# Altium schematic sheet HV_PSU.SchDoc
size A4; SheetNumber: 7; SheetTotal: 7
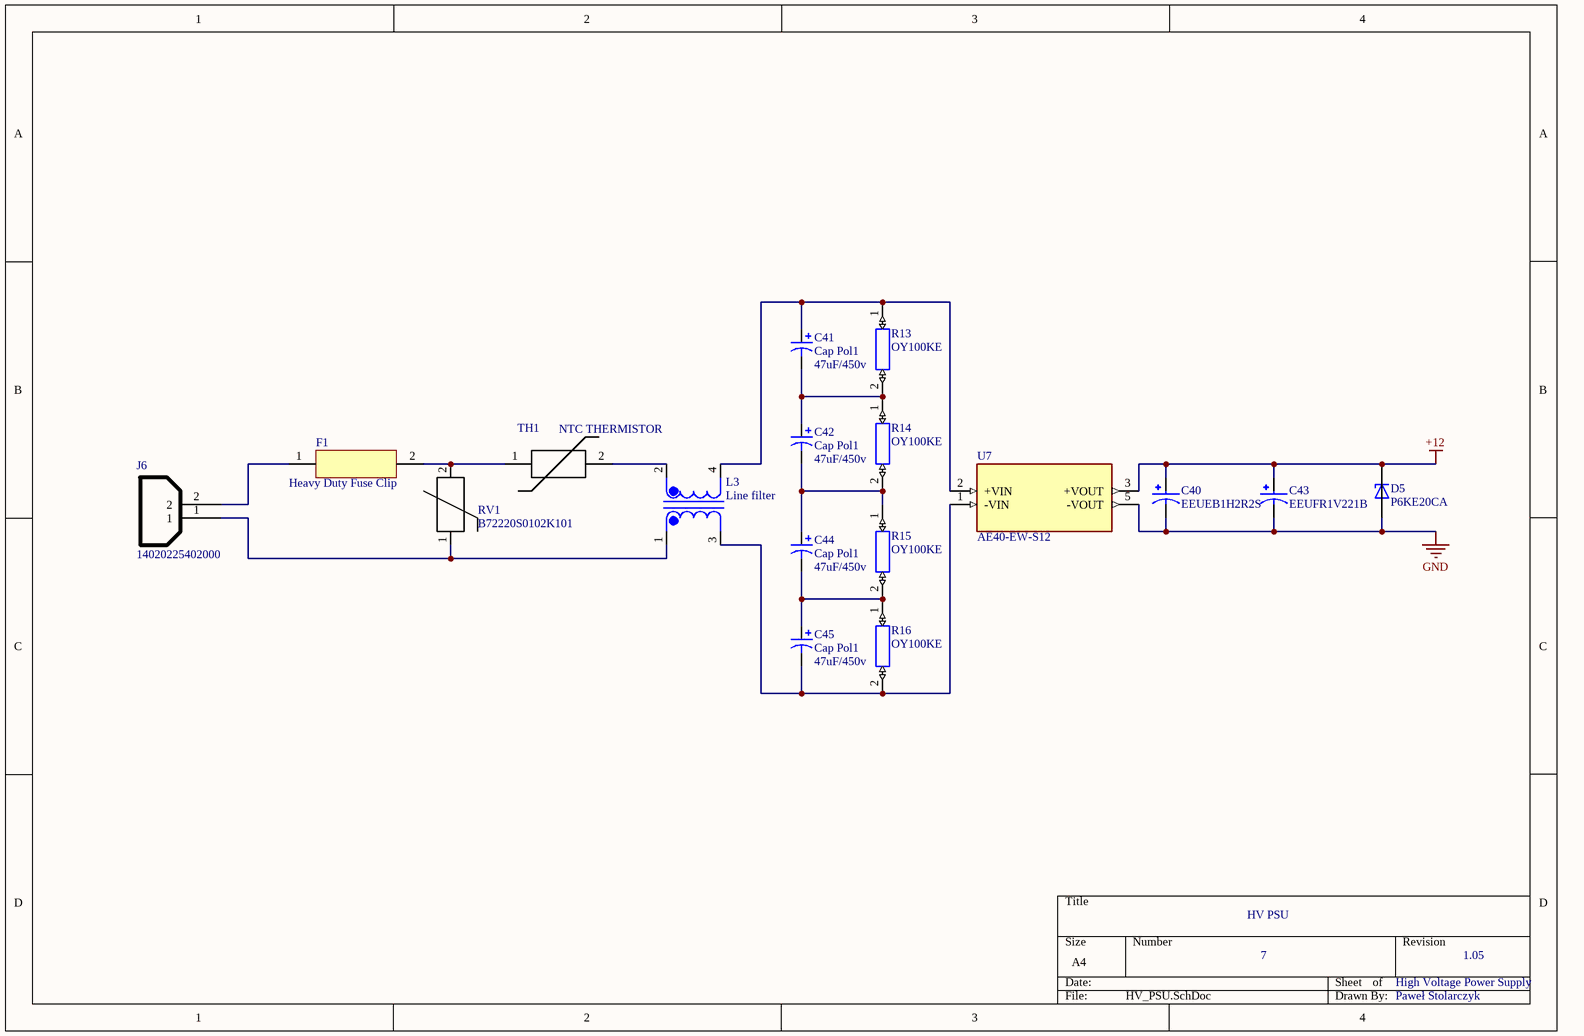
[diagram p0: HV_PSU.SchDoc]

## Parts
C40  EEUEB1H2R2S  [CAPPRD200W50D500H1100]
C41  Cap Pol1  value 47uF/450v  [RB7.6-15]
C42  Cap Pol1  value 47uF/450v  [RB7.6-15]
C43  EEUFR1V221B  [CAPPRD500W60D800H1150]
C44  Cap Pol1  value 47uF/450v  [RB7.6-15]
C45  Cap Pol1  value 47uF/450v  [RB7.6-15]
D5  P6KE20CA  [DIOAD1300W80L670D310]
F1  Heavy Duty Fuse Clip  [8040.2012.01]
J6  14020225402000  [14020225402000]
L3  Line filter  [SCF29XV-070-1R2A030JV]
R13  OY100KE  [RESAD4700W80L1900D700]
R14  OY100KE  [RESAD4700W80L1900D700]
R15  OY100KE  [RESAD4700W80L1900D700]
R16  OY100KE  [RESAD4700W80L1900D700]
RV1  B72220S0102K101  [VAR_B72220S0102K101]
TH1  NTC THERMISTOR  [MF72-10D20M]
U7  AE40-EW-S12  [CONV_AE40-EW-S12]

## Nets
+12: C40.P C43.P D5.C U7.3(+VOUT)
GND: C40.N C43.N D5.A U7.5(-VOUT)
NetC41_1: C41.1 L3.4 R13.1 U7.2(+VIN)
NetC41_2: C41.2 C42.1 R13.2 R14.1
NetC42_2: C42.2 C44.1 R14.2 R15.1
NetC44_2: C44.2 C45.1 R15.2 R16.1
NetC45_2: C45.2 L3.3 R16.2 U7.1(-VIN)
NetF1_1: F1.1 J6.2
NetF1_2: F1.2 RV1.2 TH1.1
NetJ6_1: J6.1 L3.1 RV1.1
NetL3_2: L3.2 TH1.2

## Notes on the sheet
- HV PSU
- 7
- High Voltage Power Supply
- 1.05
- Paweł Stolarczyk

## Library data of the parts
C40 = EEUEB1H2R2S: CAPACITOR, 2.2UF, 50V, 5X11MM; Capacitance:2.2F; Capacitance Tolerance: 20%; Voltage Rating:50V; Life Time @ Temperature:5000 hours @ 105C; Height:11mm; Diameter:5mm; Capacitor Terminals:Radial Leaded; Lead Spacing:2mm; Operating Temperature Range:-40C to +105C; AC Ripple Current:15mA; Capacitor Mounting:Through Hole; MF: Panasonic; Package: RADIAL-2 Panasonic; Availability: No availability data; MP: EEUEB1H2R2S; SnapEDA_Link: https://www.snapeda.com/parts/EEUEB1H2R2S/Panasonic/view-part/5793710/?ref=snap; Value: *; Check_prices: https://www.snapeda.com/parts/EEUEB1H2R2S/Panasonic/view-part/5793710/?ref=eda; Price: None
C41 C42 C44 C45 = Cap Pol1: Polarized Capacitor (Radial); Published: 8-Jun-2000; LatestRevisionDate: 17-Jul-2002; LatestRevisionNote: Re-released for DXP Platform.; PackageReference: RB7.6-15; Publisher: Altium Limited; PackageDescription: Polarized Capacitor (Radial); 2 Leads
C43 = EEUFR1V221B: Aluminum Electrolytic Capacitors - Radial Leaded 35VDC 220uF 20% L/S=5mm; MF: Panasonic; MP: EEU-FR1V221B; Purchase-URL: https://pricing.snapeda.com/search/part/EEU-FR1V221B/?ref=eda; Package: RADIAL-2 Panasonic; Value: *; Availability: In Stock; Price: None; SnapEDA_Link: https://www.snapeda.com/parts/EEU-FR1V221B/Panasonic/view-part/6222305/?ref=snap; Check_prices: https://www.snapeda.com/parts/EEU-FR1V221B/Panasonic/view-part/6222305/?ref=eda
D5 = P6KE20CA: 600W, 20V, 5%, Bidirectional, TVS; MF: Taiwan Semiconductor; Purchase-URL: https://pricing.snapeda.com/search/part/P6KE20CA/?ref=eda; Package: DO-15 Taiwan Semiconductor; Availability: In Stock; Value: *; MP: P6KE20CA; Check_prices: https://www.snapeda.com/parts/P6KE20CA/Taiwan+Semiconductor/view-part/?ref=eda; Price: None; SnapEDA_Link: https://www.snapeda.com/parts/P6KE20CA/Taiwan+Semiconductor/view-part/?ref=snap
F1 = 8040.2012.01: THT; 10x38mm; 15A
L3 = SCF29XV-070-1R2A030JV: THT; 9,9mH; 19,2mΩ; -40÷150°C; SCF; MF: KEMET; MP: SCF-02-1300; Package: Vertical-4 KEMET; Digi-Key_Purchase_URL: https://www.digikey.com/product-detail/en/kemet/SCF-02-1300/399-10776-ND/4290842?utm_source=snapeda&utm_medium=aggregator&utm_campaign=symbol; Value: *; SnapEDA_Link: https://www.snapeda.com/parts/SCF-02-1300/KEMET/view-part/1536060/?ref=snap; Digi-Key_Part_Number: 399-10776-ND
R13-R16 = OY100KE: 10 Ohms Â±10% 2W Through Hole Resistor Axial Moisture Resistant, Pulse Withstanding Ceramic; MF: Ohmite; Availability: Good; Check_prices: https://www.snapeda.com/parts/OY100KE/Ohmite/view-part/1373894/?ref=eda; SnapEDA_Link: https://www.snapeda.com/parts/OY100KE/Ohmite/view-part/1373894/?ref=snap; MP: OY100KE; Price: None; Purchase-URL: https://pricing.snapeda.com/search/part/OY100KE/?ref=eda; Package: Axial Ohmite; Value: *
RV1 = B72220S0102K101: Var MOV 1100VAC/1465VDC 6500A 1800V Thru-Hole Radial Automotive Bulk; MF: TDK ELECTRONICS; SnapEDA_Link: https://www.snapeda.com/parts/B72220S0102K101/TM+Electronics/view-part/?ref=snap; Availability: In Stock; MP: B72220S0102K101; Price: None; Check_prices: https://www.snapeda.com/parts/B72220S0102K101/TM+Electronics/view-part/?ref=eda; Package: None; Purchase-URL: https://pricing.snapeda.com/search/part/B72220S0102K101/?ref=eda; Value: *
TH1 = MF72-10D20M: 10Ω; 23mm; ±20%; THT; 2700K
U7 = AE40-EW-S12: 40 W, 6:1 Input Range, Single Regulated Output,  7 Pin DIP, 4000 Vdc Isolation, Dc-Dc Converter; MF: CUI Inc.; CUI_purchase_URL: https://www.cui.com/product/dc-dc-converters/isolated/ae40-ew-series?utm_source=snapeda.com&utm_medium=referral&utm_campaign=snapedaBOM; SnapEDA_Link: https://www.snapeda.com/parts/AE40-EW-S12/CUI/view-part/2854828/?ref=snap; Availability: Bad; Price: None; Package: DIP-7 CUI; Check_prices: https://www.snapeda.com/parts/AE40-EW-S12/CUI/view-part/2854828/?ref=eda; Value: *; Purchase-URL: https://pricing.snapeda.com/search/part/AE40-EW-S12/?ref=eda; MP: AE40-EW-S12